# Altium schematic sheet 7-Encodeurs.SchDoc
size A4
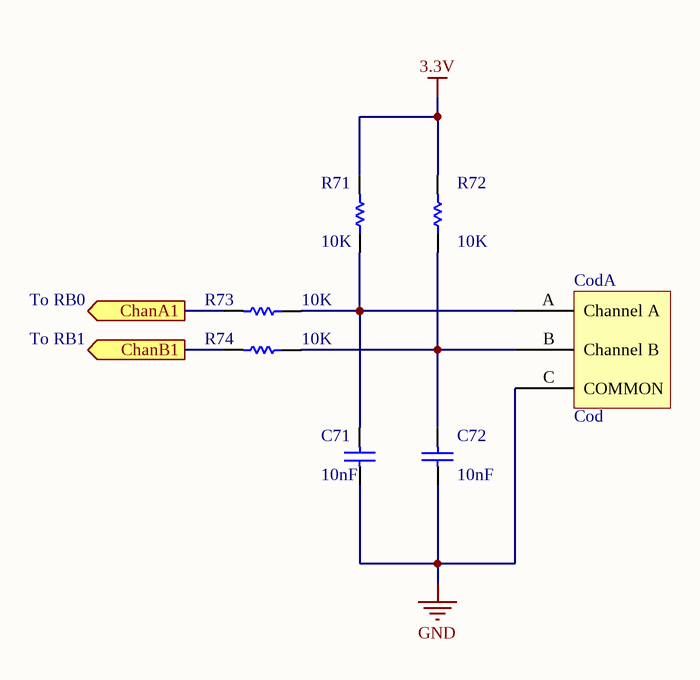
[diagram p0: 7-Encodeurs.SchDoc]

## Parts
C71  10nF  [capa 1206]
C72  10nF  [capa 1206]
Cod  Cod  (part A of 2)
R71  10K  [RES 1206]
R72  10K  [RES 1206]
R73  10K  [RES 1206]
R74  10K  [RES 1206]

## Ports
ChanA1 (out), ChanB1 (out)

## Nets
3.3V: R71.2 R72.2
GND: C71.1 C72.2 Cod.C(COMMON)
ChanA1: R73.2 ; port ChanA1
ChanB1: R74.2 ; port ChanB1
NetC71_2: C71.2 Cod.A(Channel_A) R71.1 R73.1
NetC72_1: C72.1 Cod.B(Channel_B) R72.1 R74.1

## Notes on the sheet
- To RB0
- To RB1

## Library data of the parts
C71 C72 = Cap: Capacitor; Fabricant: MULTICOMP; Fournisseur: Farnell; RefFabricant: MC1206B103M631CT; RefFournisseur: 1709222
R71-R74 = Res1: Resistor; Fabricant: MULTICOMP; Fournisseur: Farnell; RefFabricant: MC0125W1206510K; RefFournisseur: 9337016
Cod = Cod: Fabricant: N/A; Fournisseur: N/A; RefFabricant: N/A; RefFournisseur: N/A